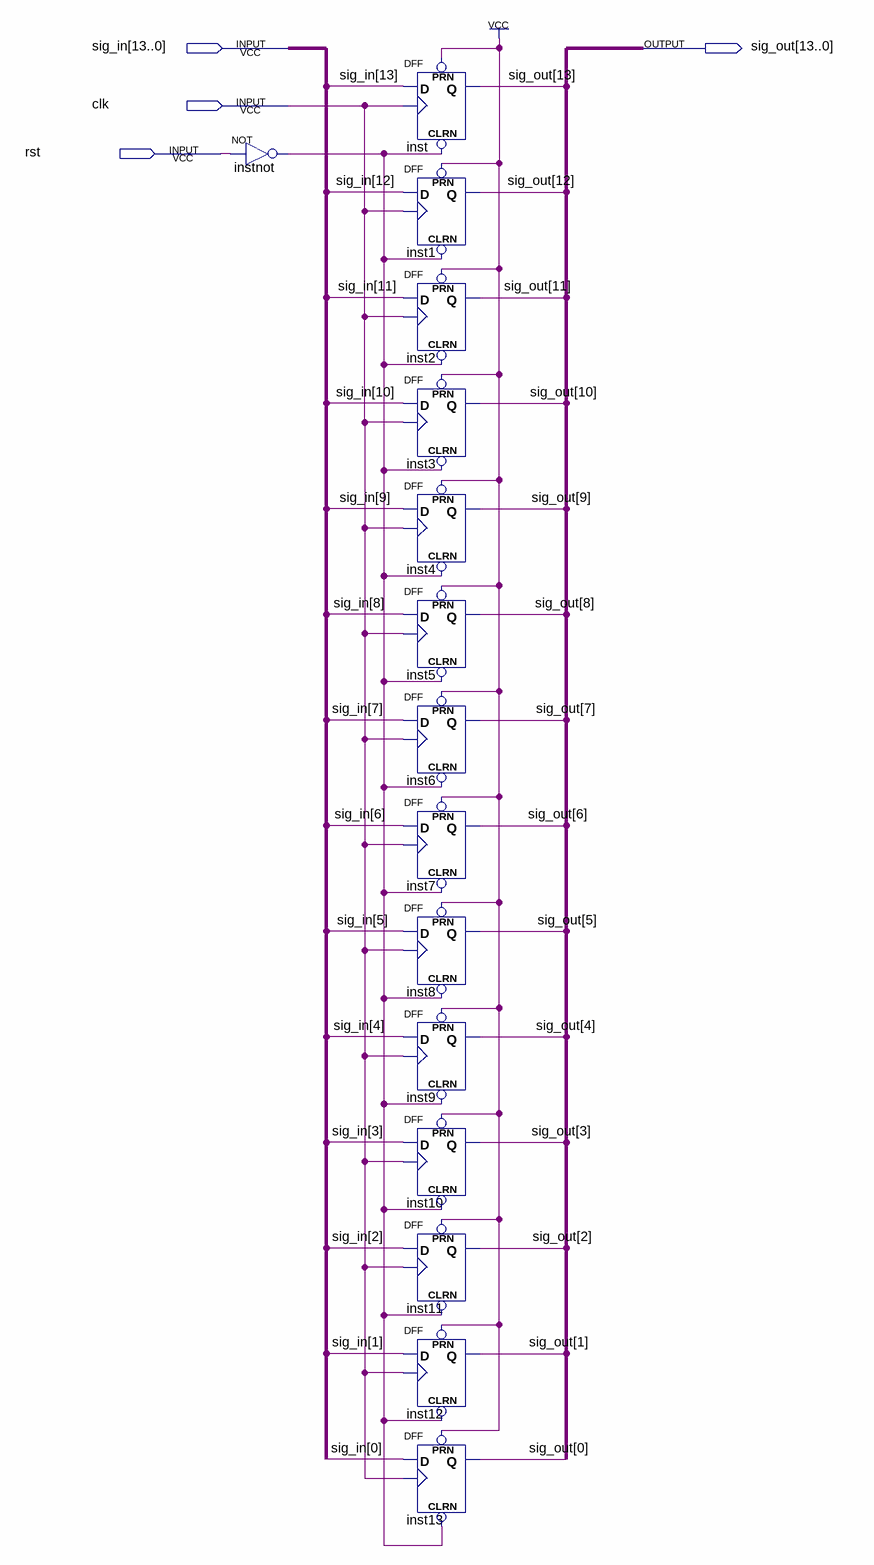
[diagram p0: schematic sheet]
// Quartus schematic delay.bdf as structural Verilog: 15 symbols, 4 pins
module delay (
  input  [13:0] sig_in,
  input  clk,
  input  rst,
  output [13:0] sig_out
);

  wire instnot_out;

  not instnot (instnot_out, rst);
  DFF inst (.CLRN(instnot_out), .CLK(clk), .D(sig_in[13]), .PRN(1'b1), .Q(sig_out[13]));
  DFF inst1 (.CLRN(instnot_out), .CLK(clk), .D(sig_in[12]), .PRN(1'b1), .Q(sig_out[12]));
  DFF inst2 (.CLRN(instnot_out), .CLK(clk), .D(sig_in[11]), .PRN(1'b1), .Q(sig_out[11]));
  DFF inst3 (.CLRN(instnot_out), .CLK(clk), .D(sig_in[10]), .PRN(1'b1), .Q(sig_out[10]));
  DFF inst4 (.CLRN(instnot_out), .CLK(clk), .D(sig_in[9]), .PRN(1'b1), .Q(sig_out[9]));
  DFF inst5 (.CLRN(instnot_out), .CLK(clk), .D(sig_in[8]), .PRN(1'b1), .Q(sig_out[8]));
  DFF inst6 (.CLRN(instnot_out), .CLK(clk), .D(sig_in[7]), .PRN(1'b1), .Q(sig_out[7]));
  DFF inst7 (.CLRN(instnot_out), .CLK(clk), .D(sig_in[6]), .PRN(1'b1), .Q(sig_out[6]));
  DFF inst8 (.CLRN(instnot_out), .CLK(clk), .D(sig_in[5]), .PRN(1'b1), .Q(sig_out[5]));
  DFF inst9 (.CLRN(instnot_out), .CLK(clk), .D(sig_in[4]), .PRN(1'b1), .Q(sig_out[4]));
  DFF inst10 (.CLRN(instnot_out), .CLK(clk), .D(sig_in[3]), .PRN(1'b1), .Q(sig_out[3]));
  DFF inst11 (.CLRN(instnot_out), .CLK(clk), .D(sig_in[2]), .PRN(1'b1), .Q(sig_out[2]));
  DFF inst12 (.CLRN(instnot_out), .CLK(clk), .D(sig_in[1]), .PRN(1'b1), .Q(sig_out[1]));
  DFF inst13 (.CLRN(instnot_out), .CLK(clk), .D(sig_in[0]), .PRN(1'b1), .Q(sig_out[0]));
endmodule
